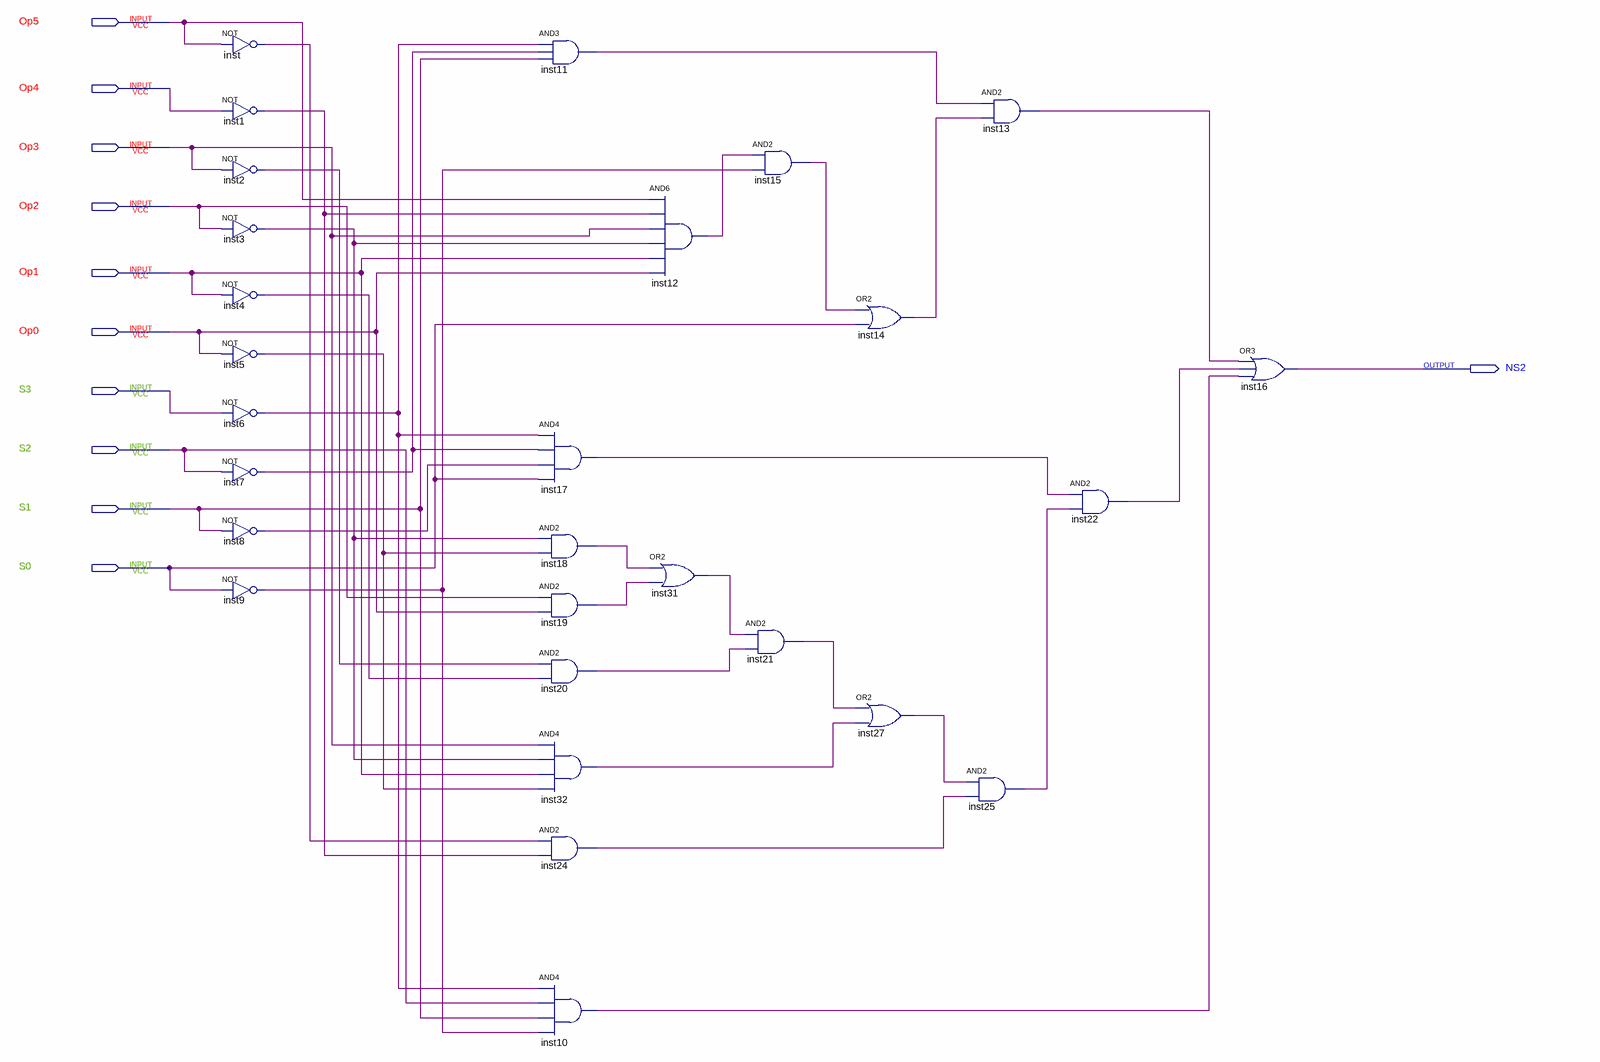
[diagram p0: schematic sheet]
// Quartus schematic NS2.bdf as structural Verilog: 28 symbols, 11 pins
module NS2 (
  input  Op5,
  input  Op4,
  input  Op3,
  input  Op2,
  input  Op1,
  input  Op0,
  input  S3,
  input  S2,
  input  S1,
  input  S0,
  output NS2
);

  wire inst1_out, inst2_out, inst3_out, inst4_out, inst5_out, inst6_out, inst7_out, inst8_out, inst9_out,
       inst10_out, inst11_out, inst12_out, inst13_out, inst14_out, inst15_out, inst17_out, inst18_out,
       inst19_out, inst20_out, inst21_out, inst22_out, inst24_out, inst25_out, inst27_out, inst31_out,
       inst32_out, inst_out;

  not inst (inst_out, Op5);
  not inst1 (inst1_out, Op4);
  not inst2 (inst2_out, Op3);
  not inst3 (inst3_out, Op2);
  not inst4 (inst4_out, Op1);
  not inst5 (inst5_out, Op0);
  not inst6 (inst6_out, S3);
  not inst7 (inst7_out, S2);
  not inst8 (inst8_out, S1);
  not inst9 (inst9_out, S0);
  and inst11 (inst11_out, inst6_out, inst7_out, S1);
  and inst17 (inst17_out, inst6_out, inst7_out, inst8_out, S0);
  and inst18 (inst18_out, inst3_out, inst5_out);
  and inst19 (inst19_out, Op2, Op0);
  and inst20 (inst20_out, inst2_out, inst4_out);
  and inst32 (inst32_out, Op3, inst3_out, Op1, inst5_out);
  and inst24 (inst24_out, inst_out, inst1_out);
  and inst10 (inst10_out, inst6_out, S2, S1, inst9_out);
  and inst12 (inst12_out, Op5, inst1_out, Op3, inst3_out, Op1, Op0);
  or inst31 (inst31_out, inst18_out, inst19_out);
  and inst15 (inst15_out, inst12_out, inst9_out);
  and inst21 (inst21_out, inst31_out, inst20_out);
  or inst14 (inst14_out, inst15_out, S0);
  or inst27 (inst27_out, inst21_out, inst32_out);
  and inst13 (inst13_out, inst11_out, inst14_out);
  and inst25 (inst25_out, inst27_out, inst24_out);
  and inst22 (inst22_out, inst17_out, inst25_out);
  or inst16 (NS2, inst13_out, inst22_out, inst10_out);
endmodule
